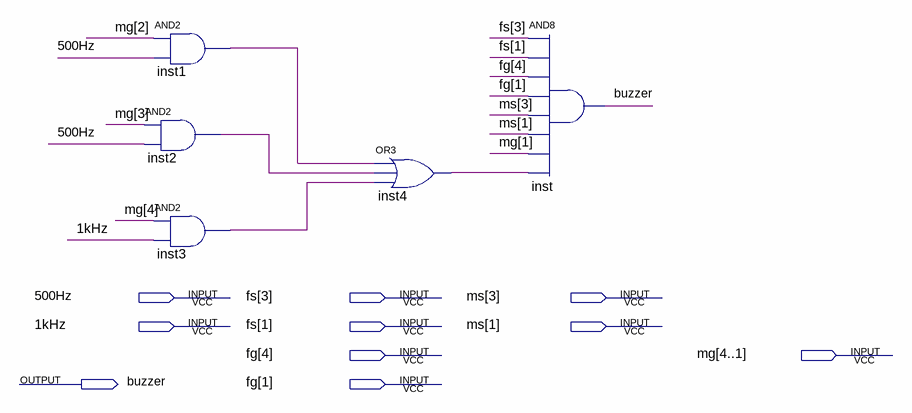
[diagram p0: schematic sheet]
// Quartus schematic baoshi.bdf as structural Verilog: 5 symbols, 10 pins
module baoshi (
  input  \500Hz ,
  input  [3:1] fs,
  input  [3:1] ms,
  input  \1kHz ,
  input  [4:1] fg,
  input  [4:1] mg,
  output buzzer
);

  wire inst1_out, inst2_out, inst3_out, inst4_out;

  and inst1 (inst1_out, mg[2], \500Hz );
  and inst2 (inst2_out, mg[3], \500Hz );
  and inst3 (inst3_out, mg[4], \1kHz );
  or inst4 (inst4_out, inst1_out, inst2_out, inst3_out);
  and inst (buzzer, fs[3], fs[1], fg[4], fg[1], ms[3], ms[1], mg[1], inst4_out);
endmodule
